# Altium schematic sheet power.SchDoc
size A4
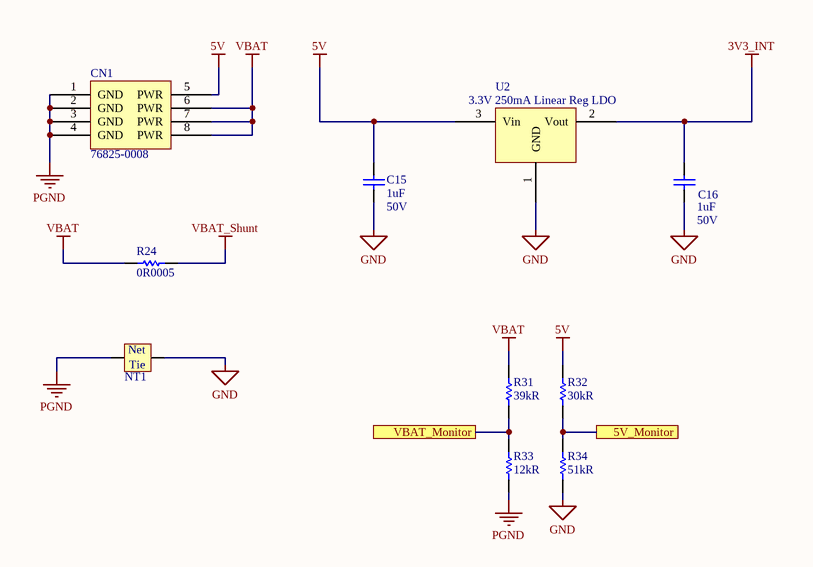
[diagram p0: power.SchDoc]

## Parts
C15  Capacitance: 1uF  Voltage: 50V  [0803 CAP]  (hidden comment: CL21B105KBFNNNG)
C16  Capacitance: 1uF  Voltage: 50V  [0803 CAP]  (hidden comment: CL21B105KBFNNNG)
CN1  76825-0008  [76825-0008-Footprint-1]
NT1  Net Tie, 20x3mm  [NETTIE_20x3mm]  (value not drawn)  (net tie, no BOM)
R24  value 0R0005  [RESC6332N(2512")]  (hidden comment: 0R0005, 1%, 3W, 2512 SMD)
R31  Resistance: 39kR  [FP-CRCW0603-e3-IPC_C]  (hidden comment: CRCW060339K0FKEA)
R32  Resistance: 30kR  [RESC1609X50X30NL10T20]  (hidden comment: CRCW060330K0FKEA)
R33  Resistance: 12kR  [RESC0603(1608)_L]  (hidden comment: 12kR, 1%, 1/10W, 0603)
R34  Resistance: 51kR  [RESC0603(1608)_N]  (hidden comment: CRCW060351K0FKEA)
U2  3.3V 250mA Linear Reg LDO  [SOT95P245X110-3N]

## Ports
5V_Monitor, VBAT_Monitor

## Nets
3V3_INT: C16.2 U2.2(Vout)
5V: C15.2 CN1.5(PWR) R32.1 U2.3(Vin)
GND: C15.1 C16.1 NT1.2 R34.1 U2.1(GND)
PGND: CN1.1(GND) CN1.2(GND) CN1.3(GND) CN1.4(GND) NT1.1 R33.1
VBAT: CN1.6(PWR) CN1.7(PWR) CN1.8(PWR) R24.1 R31.2
VBAT_Shunt: R24.2
5V_Monitor: R32.2 R34.2 ; port 5V_Monitor
VBAT_Monitor: R31.1 R33.2 ; port VBAT_Monitor

## Notes on the sheet
- (in symbol CMP-053-0007-2) Net; Tie

## Library data of the parts
C15 = CMP-00005-3: SAMSUNG ELECTRO-MECHANICS - CL21B105KBFNNNG - MLCC CAPACITORS; Dielectric: X7R; Tolerance: 10%; Material: Ceramic; Min Operating Temperature: -55°C; Length: 2mm; Termination: Wraparound; Contact Plating: Tin; Package Quantity: 3000; Mount: Surface Mount; Max Operating Temperature: 125°C; Case Code (Imperial): 0805; Thickness: 0.053inch; Case/Package: 0805; Width: 0.049inch; Voltage Rating: 50V; Depth: 1.25mm; Packaging: Tape and Reel; Case Code (Metric): 2012
C16 = CMP-00005-3: SAMSUNG ELECTRO-MECHANICS - CL21B105KBFNNNG - MLCC CAPACITORS; Tolerance: 10%; Material: Ceramic; Dielectric: X7R; Case/Package: 0805; Voltage Rating: 50V; Contact Plating: Tin; Max Operating Temperature: 125°C; Termination: Wraparound; Package Quantity: 3000; Depth: 1.25mm; Mount: Surface Mount; Min Operating Temperature: -55°C; Thickness: 0.053inch; Packaging: Tape and Reel; Case Code (Metric): 2012; Length: 2mm; Case Code (Imperial): 0805; Width: 0.049inch
CN1 = CMP-00051-3: MOLEX         76825-0008.             CONNECTOR, HEADER, 8POS, 2ROW, 5.7MM; Number of Circuits: 8; Gender: Male; Termination: Through Hole; Color: Black; REACH SVHC: Unknown; Pitch: 5.7mm; Number of Rows: 2; Number of Contacts: 8; Mount: Through Hole; Contact Plating: Tin; Contact Material: Copper; Number of Pins: 8; Orientation: Right Angle
NT1 = CMP-053-0007-2: Size: 20mmx3mm; Date Created: 2016-06-17; Source: AUVic_Integrated_Library_Virtual_Components.SchLib; Pin Count: 2; Created By: Ashwin Sira; Design Item ID: Net Tie, 20x3mm; Component Type: Net Tie; Publisher: AUVic
R24 = CMP-047-0003-1: MFG: Riedon; MFG#: CSR2512C0R0005F; Last_Revision_Note: Made; Last_Revision_By: Ashwin Sira; Created On: 2016-04-28; Last_Revision_Date: 2016-04-28; Created By: Ashwin Sira; Component Type: Standard; Design Item ID: 0R0005, 1%, 3W, 2512 SMD; Source: AUVic_Schematic_Library_Resistors.SchLib; Pin Count: 2; Publisher: AUVic
R31 = CMP-00126-2: Resistor; Thick Film; 39 Kilohms; 0.1 W; 1%; SMT; 0603; TCR 37 ppm/DegC; Cut Tape; Max Power Dissipation: 100mW; Voltage Rating: 75V; Temperature Coefficient: 100ppm/°C; Construction: Rectangular; Mount: Surface Mount; Packaging: Tape and Reel; Weight: 7.1E-05oz; Resistor Type: Thick Film; Features: Automotive AEC-Q200; Number of Terminations: 2; Case Code (Metric): 1608; Number of Pins: 2; Case/Package: 0603; Package Quantity: 10; REACH SVHC: Unknown; Max Operating Temperature: 155°C; Termination: SMD/SMT; Contact Plating: Tin; Military Standard: Not; Power Rating: 100mW; Depth: 0.85mm; Radiation Hardening: No; Min Operating Temperature: -55°C; Series: CRCW; Lead Free: Lead Free; Case Code (Imperial): 0603; Width: 0.033inch; Technology: THICK FILM; Tolerance: 1%; Height: 0.45mm; Voltage Rating (DC): 75V; Length: 1.55mm; Size Code: 0603; Resistance Tolerance: 1%
R32 = CMP-00125-1: Resistor SMD 30 kOhm 0603 PU=5000 ST, CRCW060330K0FKEA, Vishay; Max Power Dissipation: 100mW; Temperature Coefficient: 100ppm/°C; Resistance Tolerance: 1%; Voltage Rating: 75V; Min Operating Temperature: -55°C; Radiation Hardening: No; Width: 0.85mm; REACH SVHC: Unknown; Power Rating: 100mW; Max Operating Temperature: 155°C; Case Code (Metric): 1608; Length: 1.55mm; Size Code: 0603; Number of Pins: 2; Contact Plating: Tin; Weight: 7.1E-05oz; Termination: SMD/SMT; Mount: Surface Mount; Packaging: Tape and Reel; Technology: THICK FILM; Features: Automotive AEC-Q200; Resistor Type: Thick Film; Construction: Rectangular; Height: 0.45mm; Series: CRCW; Case/Package: 0603; Number of Terminations: 2; Military Standard: Not; Case Code (Imperial): 0603; Lead Free: Lead Free; Depth: 0.85mm; Package Quantity: 5000; Voltage Rating (DC): 75V; Tolerance: 1%
R33 = CMP-00088-1: TE Connectivity CRG0603 Series Thick Film Surface Mount Resistor 0603 Case 12k 1% 0.1W 100ppm/C; Max Power Dissipation: 100mW; Temperature Coefficient: 100ppm/°C; Number of Terminations: 2; Packaging: Tape and Reel; Width: 0.031inch; Military Standard: Not; Case/Package: 0603; Depth: 0.8mm; Mount: Surface Mount; Tolerance: 1%; Length: 0.063inch; Package Quantity: 5000; Max Operating Temperature: 125°C; Height: 0.022inch; Radiation Hardening: No; Resistor Type: Thick Film; Min Operating Temperature: -55°C
R34 = CMP-00124-1: VISHAY         CRCW060351K0FKEA.            Surface Mount Chip Resistor, Thick Film, AEC-Q200 CRCW Series, 51 kohm, 100 mW,  1%, 75 V; Power Rating: 100mW; Voltage Rating (DC): 75V; Temperature Coefficient: 100ppm/°C; Number of Terminations: 2; Series: CRCW; REACH SVHC: Unknown; Size Code: 0603; Military Standard: Not; Resistance Tolerance: 1%; Height: 0.45mm; Termination: SMD/SMT; Number of Pins: 2; Case Code (Imperial): 0603; Case/Package: 0603; Construction: Rectangular; Weight: 7.1E-05oz; Contact Plating: Tin; Max Operating Temperature: 155°C; Tolerance: 1%; Technology: THICK FILM; Package Quantity: 10; Width: 0.85mm; Packaging: Tape and Reel; Max Power Dissipation: 100mW; Voltage Rating: 75V; Radiation Hardening: No; Resistor Type: Thick Film; Features: Automotive AEC-Q200; Min Operating Temperature: -55°C; Lead Free: Lead Free; Length: 1.55mm; Depth: 0.85mm; Case Code (Metric): 1608
U2 = CMP-00003-1: IC REG LINEAR 3.3V 250MA SOT23-3; Max Input Voltage: 6.6V; Accuracy: 2%; Polarity: Positive; Number of Outputs: 1; Output Type: Fixed; Dropout Voltage: 400mV; Quiescent Current: 1uA; Min Input Voltage: 2.5V; Min Operating Temperature: -40°C; Supplier 1: Digi-Key; Supplier Part Number 1: AP2138N-3.3TRG1; Width: 1.7mm; Length: 3.02mm; Height: 1.3mm; Output Current: 250mA; Created By: Poorna Chander Kalidas; Number of Regulators: 1; Number of Pins: 3; Package Quantity: 3000; Date Created: June 26, 2020; Output Voltage: 3.3V; Max Operating Temperature: 85°C; Max Output Current: 250mA; Weight: 0.000282oz; Packaging: Tape and Reel; Lead Free: Lead Free; Mount: Surface Mount; Case/Package: SOT-23-3